# Altium schematic sheet LED_String_NE2G757GT.SchDoc: STB Light Board - green String
size A4; Author: flmoll; DrawnBy: flmoll; Organization: PBL; Revision: A; SheetNumber: 18; SheetTotal: 20
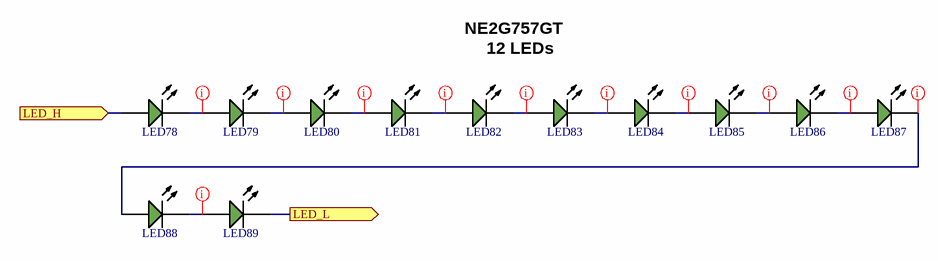
[diagram p0: LED_String_NE2G757GT.SchDoc]

## Parts
LED78  NE2G757GT  [NE2G757GT]  (value not drawn)
LED79  NE2G757GT  [NE2G757GT]  (value not drawn)
LED80  NE2G757GT  [NE2G757GT]  (value not drawn)
LED81  NE2G757GT  [NE2G757GT]  (value not drawn)
LED82  NE2G757GT  [NE2G757GT]  (value not drawn)
LED83  NE2G757GT  [NE2G757GT]  (value not drawn)
LED84  NE2G757GT  [NE2G757GT]  (value not drawn)
LED85  NE2G757GT  [NE2G757GT]  (value not drawn)
LED86  NE2G757GT  [NE2G757GT]  (value not drawn)
LED87  NE2G757GT  [NE2G757GT]  (value not drawn)
LED88  NE2G757GT  [NE2G757GT]  (value not drawn)
LED89  NE2G757GT  [NE2G757GT]  (value not drawn)

## Ports
LED_H (in, see LED_Driver_NE2G757GT[3B]), LED_L (out, see LED_Driver_NE2G757GT[3B])

## Nets
LED_H: LED78.2(A) ; port LED_H
LED_L: LED89.1(K) ; port LED_L
NetLED78_1: LED78.1(K) LED79.2(A)
NetLED79_1: LED79.1(K) LED80.2(A)
NetLED80_1: LED80.1(K) LED81.2(A)
NetLED81_1: LED81.1(K) LED82.2(A)
NetLED82_1: LED82.1(K) LED83.2(A)
NetLED83_1: LED83.1(K) LED84.2(A)
NetLED84_1: LED84.1(K) LED85.2(A)
NetLED85_1: LED85.1(K) LED86.2(A)
NetLED86_1: LED86.1(K) LED87.2(A)
NetLED87_1: LED87.1(K) LED88.2(A)
NetLED88_1: LED88.1(K) LED89.2(A)

## Layout directives
net class LED: NetLED78_1, NetLED79_1, NetLED80_1, NetLED81_1, NetLED82_1, NetLED83_1, NetLED84_1, NetLED85_1, NetLED86_1, NetLED87_1, NetLED88_1

## Notes on the sheet
- NE2G757GT
- 12 LEDs
- 1
- 2
- 3
- 4
- A
- B
- C
- Project:
- D
- Date:
- Drawing number:
- Rev:
- Format:
- A4 Q
- Drawn by:
- Laboratory:
- Page
- Sheet:
- of
- File:

## Library data of the parts
LED78-LED89 = CMP-02061-1: SMD LED Green 3,5 V, 33 lm 3030 (1212); Manufacturer: Nichia; Optoelectronic Device Type: SINGLE COLOR LED; Vf: 3.5 V; Intensity: 33 lm; REACH SVHC: No SVHC; RoHS Compliant: Yes; Color: Green; Manufacturer Part Number: NE2G757GT